# Altium schematic sheet Sheet1.SchDoc
size A4
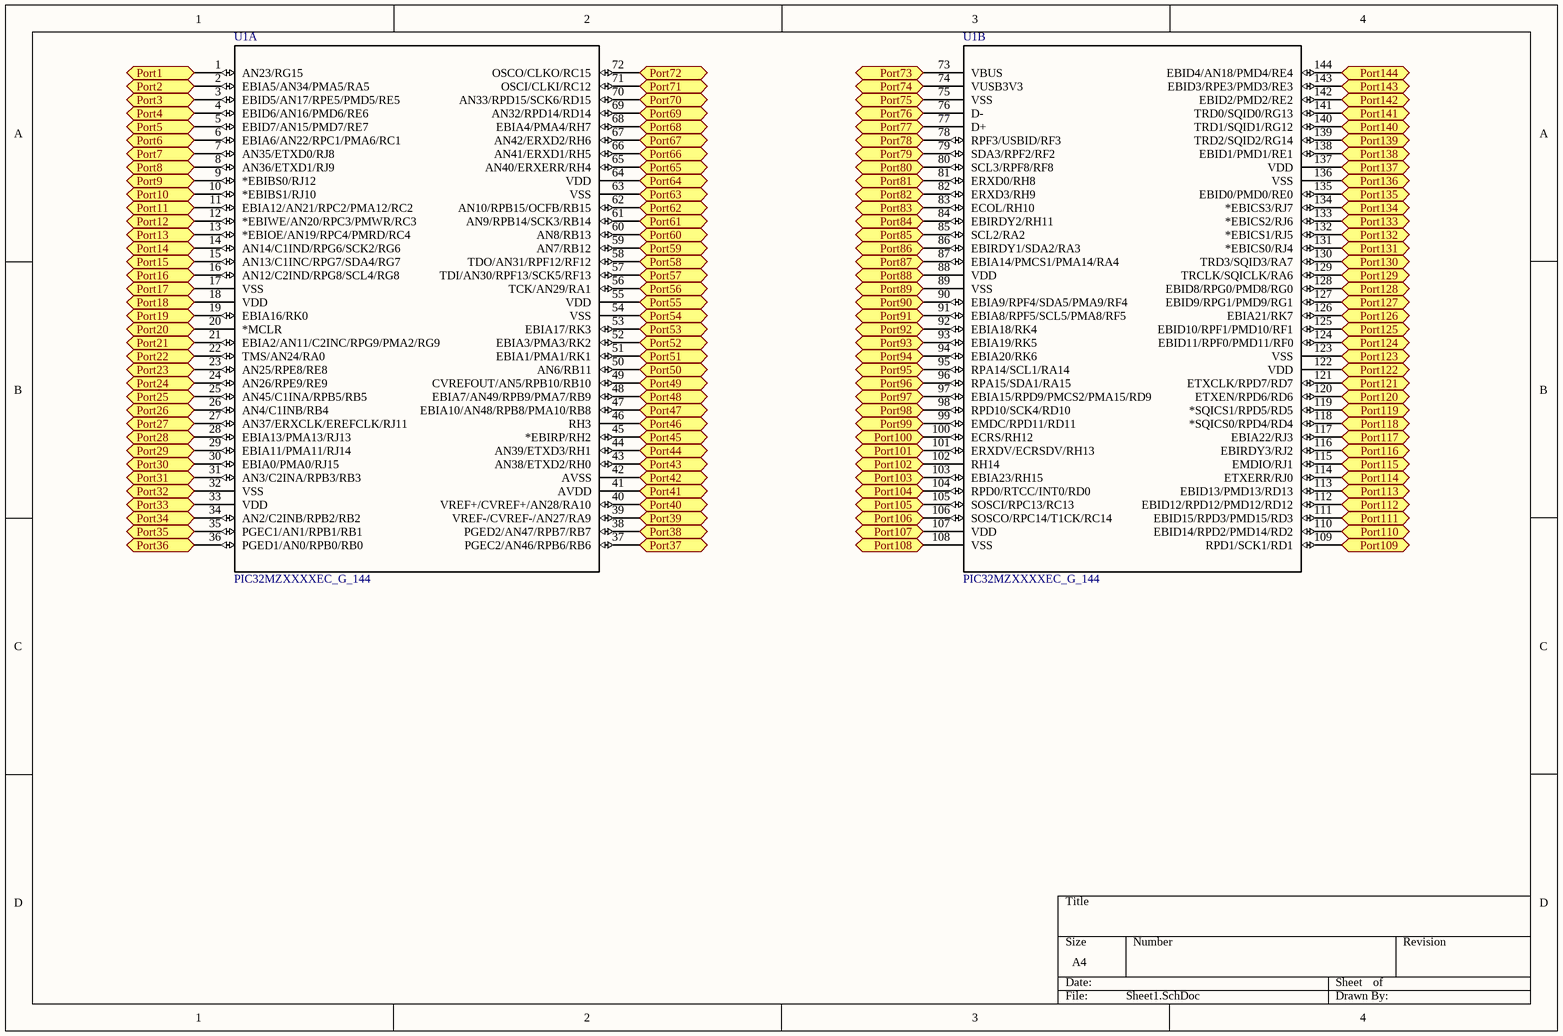
[diagram p0: Sheet1.SchDoc]

## Parts
U1  PIC32MZXXXXEC_G_144  [TQFP144_16X16MC]  (parts A,B of 2)

## Ports
Port1, Port2, Port3, Port4, Port5, Port6, Port7, Port8, Port9, Port10, Port11, Port12, Port13, Port14, Port15, Port16, Port17, Port18, Port19, Port20, Port21, Port22, Port23, Port24, Port25, Port26, Port27, Port28, Port29, Port30, Port31, Port32, Port33, Port34, Port35, Port36, Port37, Port38, Port39, Port40, Port41, Port42, Port43, Port44, Port45, Port46, Port47, Port48, Port49, Port50, Port51, Port52, Port53, Port54, Port55, Port56, Port57, Port58, Port59, Port60, Port61, Port62, Port63, Port64, Port65, Port66, Port67, Port68, Port69, Port70, Port71, Port72, Port73, Port74, Port75, Port76, Port77, Port78, Port79, Port80, Port81, Port82, Port83, Port84, Port85, Port86, Port87, Port88, Port89, Port90, Port91, Port92, Port93, Port94, Port95, Port96, Port97, Port98, Port99, Port100, Port101, Port102, Port103, Port104, Port105, Port106, Port107, Port108, Port109, Port110, Port111, Port112, Port113, Port114, Port115, Port116, Port117, Port118, Port119, Port120, Port121, Port122, Port123, Port124, Port125, Port126, Port127, Port128, Port129, Port130, Port131, Port132, Port133, Port134, Port135, Port136, Port137, Port138, Port139, Port140, Port141, Port142, Port143, Port144

## Nets
Port1: U1.1(AN23/RG15) ; port Port1
Port2: U1.2(EBIA5/AN34/PMA5/RA5) ; port Port2
Port3: U1.3(EBID5/AN17/RPE5/PMD5/RE5) ; port Port3
Port4: U1.4(EBID6/AN16/PMD6/RE6) ; port Port4
Port5: U1.5(EBID7/AN15/PMD7/RE7) ; port Port5
Port6: U1.6(EBIA6/AN22/RPC1/PMA6/RC1) ; port Port6
Port7: U1.7(AN35/ETXD0/RJ8) ; port Port7
Port8: U1.8(AN36/ETXD1/RJ9) ; port Port8
Port9: U1.9(*EBIBS0/RJ12) ; port Port9
Port10: U1.10(*EBIBS1/RJ10) ; port Port10
Port11: U1.11(EBIA12/AN21/RPC2/PMA12/RC2) ; port Port11
Port12: U1.12(*EBIWE/AN20/RPC3/PMWR/RC3) ; port Port12
Port13: U1.13(*EBIOE/AN19/RPC4/PMRD/RC4) ; port Port13
Port14: U1.14(AN14/C1IND/RPG6/SCK2/RG6) ; port Port14
Port15: U1.15(AN13/C1INC/RPG7/SDA4/RG7) ; port Port15
Port16: U1.16(AN12/C2IND/RPG8/SCL4/RG8) ; port Port16
Port17: U1.17(VSS) ; port Port17
Port18: U1.18(VDD) ; port Port18
Port19: U1.19(EBIA16/RK0) ; port Port19
Port20: U1.20(*MCLR) ; port Port20
Port21: U1.21(EBIA2/AN11/C2INC/RPG9/PMA2/RG9) ; port Port21
Port22: U1.22(TMS/AN24/RA0) ; port Port22
Port23: U1.23(AN25/RPE8/RE8) ; port Port23
Port24: U1.24(AN26/RPE9/RE9) ; port Port24
Port25: U1.25(AN45/C1INA/RPB5/RB5) ; port Port25
Port26: U1.26(AN4/C1INB/RB4) ; port Port26
Port27: U1.27(AN37/ERXCLK/EREFCLK/RJ11) ; port Port27
Port28: U1.28(EBIA13/PMA13/RJ13) ; port Port28
Port29: U1.29(EBIA11/PMA11/RJ14) ; port Port29
Port30: U1.30(EBIA0/PMA0/RJ15) ; port Port30
Port31: U1.31(AN3/C2INA/RPB3/RB3) ; port Port31
Port32: U1.32(VSS) ; port Port32
Port33: U1.33(VDD) ; port Port33
Port34: U1.34(AN2/C2INB/RPB2/RB2) ; port Port34
Port35: U1.35(PGEC1/AN1/RPB1/RB1) ; port Port35
Port36: U1.36(PGED1/AN0/RPB0/RB0) ; port Port36
Port37: U1.37(PGEC2/AN46/RPB6/RB6) ; port Port37
Port38: U1.38(PGED2/AN47/RPB7/RB7) ; port Port38
Port39: U1.39(VREF-/CVREF-/AN27/RA9) ; port Port39
Port40: U1.40(VREF+/CVREF+/AN28/RA10) ; port Port40
Port41: U1.41(AVDD) ; port Port41
Port42: U1.42(AVSS) ; port Port42
Port43: U1.43(AN38/ETXD2/RH0) ; port Port43
Port44: U1.44(AN39/ETXD3/RH1) ; port Port44
Port45: U1.45(*EBIRP/RH2) ; port Port45
Port46: U1.46(RH3) ; port Port46
Port47: U1.47(EBIA10/AN48/RPB8/PMA10/RB8) ; port Port47
Port48: U1.48(EBIA7/AN49/RPB9/PMA7/RB9) ; port Port48
Port49: U1.49(CVREFOUT/AN5/RPB10/RB10) ; port Port49
Port50: U1.50(AN6/RB11) ; port Port50
Port51: U1.51(EBIA1/PMA1/RK1) ; port Port51
Port52: U1.52(EBIA3/PMA3/RK2) ; port Port52
Port53: U1.53(EBIA17/RK3) ; port Port53
Port54: U1.54(VSS) ; port Port54
Port55: U1.55(VDD) ; port Port55
Port56: U1.56(TCK/AN29/RA1) ; port Port56
Port57: U1.57(TDI/AN30/RPF13/SCK5/RF13) ; port Port57
Port58: U1.58(TDO/AN31/RPF12/RF12) ; port Port58
Port59: U1.59(AN7/RB12) ; port Port59
Port60: U1.60(AN8/RB13) ; port Port60
Port61: U1.61(AN9/RPB14/SCK3/RB14) ; port Port61
Port62: U1.62(AN10/RPB15/OCFB/RB15) ; port Port62
Port63: U1.63(VSS) ; port Port63
Port64: U1.64(VDD) ; port Port64
Port65: U1.65(AN40/ERXERR/RH4) ; port Port65
Port66: U1.66(AN41/ERXD1/RH5) ; port Port66
Port67: U1.67(AN42/ERXD2/RH6) ; port Port67
Port68: U1.68(EBIA4/PMA4/RH7) ; port Port68
Port69: U1.69(AN32/RPD14/RD14) ; port Port69
Port70: U1.70(AN33/RPD15/SCK6/RD15) ; port Port70
Port71: U1.71(OSCI/CLKI/RC12) ; port Port71
Port72: U1.72(OSCO/CLKO/RC15) ; port Port72
Port73: U1.73(VBUS) ; port Port73
Port74: U1.74(VUSB3V3) ; port Port74
Port75: U1.75(VSS) ; port Port75
Port76: U1.76(D-) ; port Port76
Port77: U1.77(D+) ; port Port77
Port78: U1.78(RPF3/USBID/RF3) ; port Port78
Port79: U1.79(SDA3/RPF2/RF2) ; port Port79
Port80: U1.80(SCL3/RPF8/RF8) ; port Port80
Port81: U1.81(ERXD0/RH8) ; port Port81
Port82: U1.82(ERXD3/RH9) ; port Port82
Port83: U1.83(ECOL/RH10) ; port Port83
Port84: U1.84(EBIRDY2/RH11) ; port Port84
Port85: U1.85(SCL2/RA2) ; port Port85
Port86: U1.86(EBIRDY1/SDA2/RA3) ; port Port86
Port87: U1.87(EBIA14/PMCS1/PMA14/RA4) ; port Port87
Port88: U1.88(VDD) ; port Port88
Port89: U1.89(VSS) ; port Port89
Port90: U1.90(EBIA9/RPF4/SDA5/PMA9/RF4) ; port Port90
Port91: U1.91(EBIA8/RPF5/SCL5/PMA8/RF5) ; port Port91
Port92: U1.92(EBIA18/RK4) ; port Port92
Port93: U1.93(EBIA19/RK5) ; port Port93
Port94: U1.94(EBIA20/RK6) ; port Port94
Port95: U1.95(RPA14/SCL1/RA14) ; port Port95
Port96: U1.96(RPA15/SDA1/RA15) ; port Port96
Port97: U1.97(EBIA15/RPD9/PMCS2/PMA15/RD9) ; port Port97
Port98: U1.98(RPD10/SCK4/RD10) ; port Port98
Port99: U1.99(EMDC/RPD11/RD11) ; port Port99
Port100: U1.100(ECRS/RH12) ; port Port100
Port101: U1.101(ERXDV/ECRSDV/RH13) ; port Port101
Port102: U1.102(RH14) ; port Port102
Port103: U1.103(EBIA23/RH15) ; port Port103
Port104: U1.104(RPD0/RTCC/INT0/RD0) ; port Port104
Port105: U1.105(SOSCI/RPC13/RC13) ; port Port105
Port106: U1.106(SOSCO/RPC14/T1CK/RC14) ; port Port106
Port107: U1.107(VDD) ; port Port107
Port108: U1.108(VSS) ; port Port108
Port109: U1.109(RPD1/SCK1/RD1) ; port Port109
Port110: U1.110(EBID14/RPD2/PMD14/RD2) ; port Port110
Port111: U1.111(EBID15/RPD3/PMD15/RD3) ; port Port111
Port112: U1.112(EBID12/RPD12/PMD12/RD12) ; port Port112
Port113: U1.113(EBID13/PMD13/RD13) ; port Port113
Port114: U1.114(ETXERR/RJ0) ; port Port114
Port115: U1.115(EMDIO/RJ1) ; port Port115
Port116: U1.116(EBIRDY3/RJ2) ; port Port116
Port117: U1.117(EBIA22/RJ3) ; port Port117
Port118: U1.118(*SQICS0/RPD4/RD4) ; port Port118
Port119: U1.119(*SQICS1/RPD5/RD5) ; port Port119
Port120: U1.120(ETXEN/RPD6/RD6) ; port Port120
Port121: U1.121(ETXCLK/RPD7/RD7) ; port Port121
Port122: U1.122(VDD) ; port Port122
Port123: U1.123(VSS) ; port Port123
Port124: U1.124(EBID11/RPF0/PMD11/RF0) ; port Port124
Port125: U1.125(EBID10/RPF1/PMD10/RF1) ; port Port125
Port126: U1.126(EBIA21/RK7) ; port Port126
Port127: U1.127(EBID9/RPG1/PMD9/RG1) ; port Port127
Port128: U1.128(EBID8/RPG0/PMD8/RG0) ; port Port128
Port129: U1.129(TRCLK/SQICLK/RA6) ; port Port129
Port130: U1.130(TRD3/SQID3/RA7) ; port Port130
Port131: U1.131(*EBICS0/RJ4) ; port Port131
Port132: U1.132(*EBICS1/RJ5) ; port Port132
Port133: U1.133(*EBICS2/RJ6) ; port Port133
Port134: U1.134(*EBICS3/RJ7) ; port Port134
Port135: U1.135(EBID0/PMD0/RE0) ; port Port135
Port136: U1.136(VSS) ; port Port136
Port137: U1.137(VDD) ; port Port137
Port138: U1.138(EBID1/PMD1/RE1) ; port Port138
Port139: U1.139(TRD2/SQID2/RG14) ; port Port139
Port140: U1.140(TRD1/SQID1/RG12) ; port Port140
Port141: U1.141(TRD0/SQID0/RG13) ; port Port141
Port142: U1.142(EBID2/PMD2/RE2) ; port Port142
Port143: U1.143(EBID3/RPE3/PMD3/RE3) ; port Port143
Port144: U1.144(EBID4/AN18/PMD4/RE4) ; port Port144

## Library data of the parts
U1 = PIC32MZXXXXEC_G_: Imported; Manufacturer_Part_Number: pic32mz2048ech144-i/ph; Vendor: Microchip; RefDes: RefDes; Type: Type; Value: Value